# EAGLE design sonoff_opto (EAGLE 7.5.0)
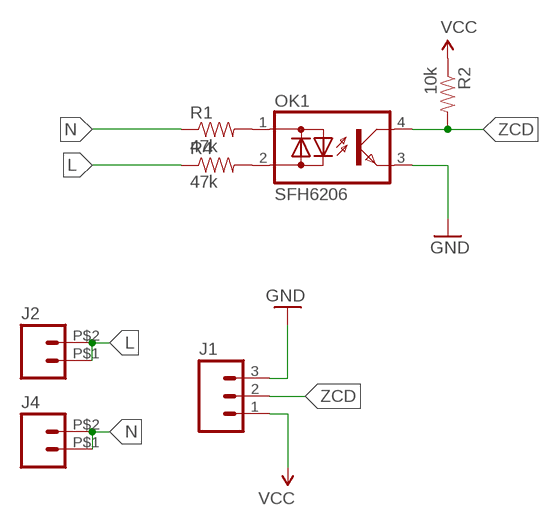
[diagram p0: schematic, sheet 1]

## Parts
J1  M03PTH  [1X03]
J2  M02PTH2  [1X02_BIG]
J4  M02PTH2  [1X02_BIG]
OK1  SFH6206  [DIL4-SMD]
R1  47k  RESISTORPTH-1/4W  [AXIAL-0.4]
R2  10k  RESISTOR0805-RES  [0805]
R4  47k  RESISTORPTH-1/4W  [AXIAL-0.4]

## Nets
GND: J1.3 OK1.3(E)
L: J2.P$1 J2.P$2 R4.P$1
N: J4.P$1 J4.P$2 R1.P$1
N$1: OK1.1(AC1) R1.P$2
N$3: OK1.2(AC2) R4.P$2
VCC: J1.1 R2.1
ZCD: J1.2 OK1.4(C) R2.2

## Library data of the parts
J1 = SparkFun-Connectors:M03: Header 3 Standard 3-pin 0.1" header. Use with straight break away headers (SKU : PRT-00116), right angle break away headers (PRT-00553), swiss pins (PRT-00743), machine pins (PRT-00117), and female headers (PRT-00115). Molex polarized connector foot print use with SKU : PRT-08232 with associated crimp pins and housings.
J2 J4 = SparkFun-Connectors:M02: Standard 2-pin 0.1" header. Use with - straight break away headers ( PRT-00116) - right angle break away headers (PRT-00553) - swiss pins (PRT-00743) - machine pins (PRT-00117) - female headers (PRT-00115) Molex polarized connector foot print use with: PRT-08233 with associated crimp pins and housings. 2.54_SCREWTERM for use with PRT-10571. 3.5mm Screw Terminal footprints for PRT-08084 5mm Screw Terminal footprints for use with PRT-08432
OK1 = optodevices:SFH620: Optocoupler, Phototransistor Output, AC Input Source: http://www.vishay.com/docs/83675/sfh620.pdf
R1 R2 R4 = SparkFun-Passives:RESISTOR: Resistor Basic schematic elements and footprints for 0603, 1206, and PTH resistors.

## Board
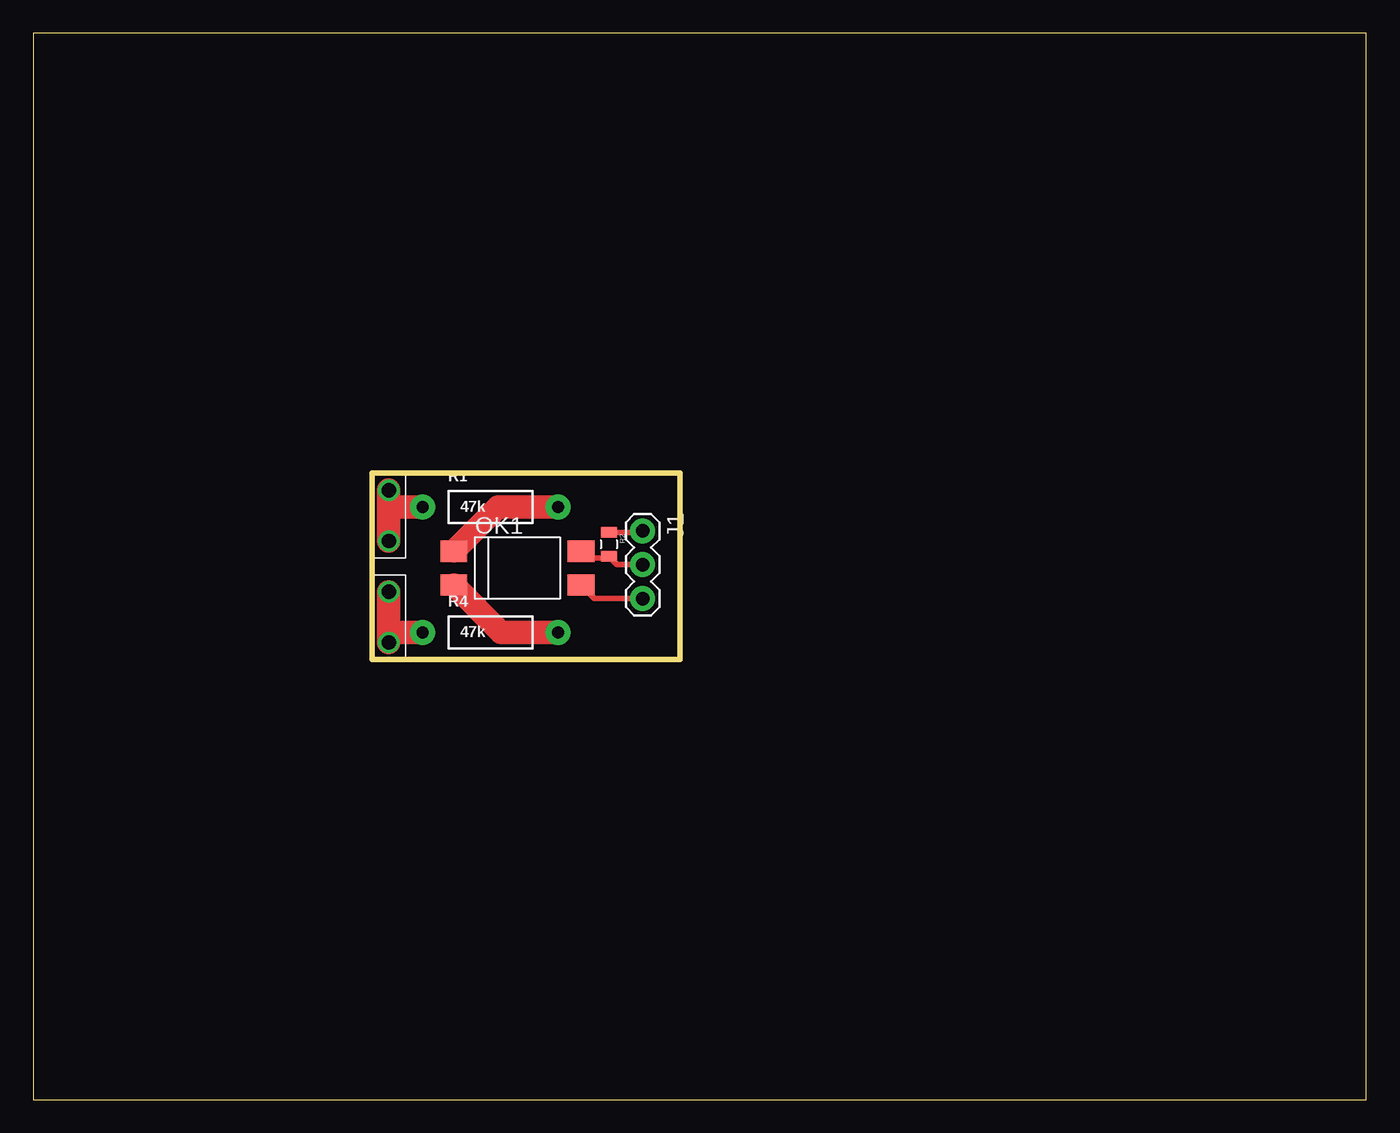
[diagram p1: board, top side]

Size 100 x 80 mm. Coordinates in mm from the lower left corner, seen from the top.
Outline: 0,0 100,0 100,80 0,80 0,0
Outline: 25.4,46.99 48.51,46.99 48.51,33.02 25.4,33.02 25.4,46.99
Copper layers (1*16): Top 0.035mm / dielectric 1.5mm / Bottom 0.035mm
Design rules "default": minimum track width 10mil, minimum drill 24mil, track to track 8mil, track to pad 8mil, pad to pad 8mil, via to via 8mil, smd to smd 8mil, copper to edge 40mil, drill to drill 8mil, minimum pad ring 10mil, minimum via ring 8mil, stop-mask expansion 4mil, vias tented up to drill 0mil, thermal gap 10mil

### Footprints (pad centres in the part's own frame; a part is rotated, then mirrored left to right if it is on the bottom)
1X03 = drill 1.016 pad 1.88: 1 0,0; 2 2.54,0; 3 5.08,0
1X02_BIG = drill 1.067: P$1 0,0; P$2 3.81,0
DIL4-SMD = smd 1.6 x 2: 1 -1.27,-4.77; 2 1.27,-4.77; 3 1.27,4.77; 4 -1.27,4.77
AXIAL-0.4 = drill 0.9 pad 1.88: P$1 -5.08,0; P$2 5.08,0
0805 = smd 0.8 x 1.2: 1 -0.9,0; 2 0.9,0

### Placement (x,y rotation side)
J1  45.72,42.67 270 top
J2  26.67,34.29 90 top
J4  26.67,45.72 270 top
OK1  36.32,39.88 270 top
R1  34.29,44.45 0 top
R2  43.18,41.66 270 top
R4  34.29,35.05 0 top

### Tracks (layer width: path | path; a pad name or v marks a point on that pad's centre or on a via)
GND
  Top 0.406: J1.3 42.11,37.59 OK1.3
L
  Top 0.406: 26.67,35.05 26.67,35.56
  Top 1.778: J2.P$2 26.67,35.56 J2.P$1 | R4.P$1 26.67,35.05
N
  Top 1.778: J4.P$1 26.67,44.45 | 26.67,44.45 J4.P$2 | R1.P$1 26.67,44.45
N$1
  Top 1.778: R1.P$2 34.85,44.45 OK1.1
N$3
  Top 1.778: R4.P$2 35.11,35.05 OK1.2
VCC
  Top 0.406: R2.1 45.6,42.56 J1.1
ZCD
  Top 0.406: J1.2 43.8,40.13 R2.2 43.18,40.64 41.6,40.64 OK1.4